# EAGLE schematic Power (EAGLE 9.6.2)
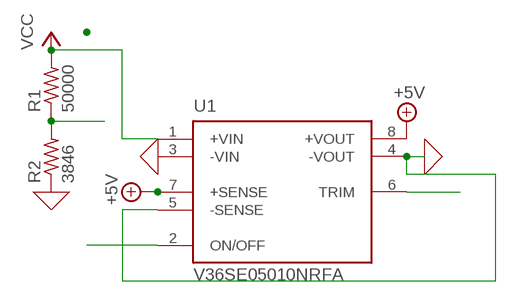
[diagram p0: schematic, sheet 1]

## Parts
R1  50000  R-US_0204/7  [0204/7]
R2  3846  R-US_0204/7  [0204/7]
U1  V36SE05010NRFA  [MODULE_V36SE05010NRFA]

## Nets
0: R2.1 U1.3(-VIN) U1.4(-VOUT) U1.5(-SENSE) ; supply symbol labelled GND
+5V: U1.7(+SENSE) U1.8(+VOUT)
N$2: U1.2(ON/OFF)
N$3: U1.6(TRIM)
N$4: R1.1 R2.2
VCC: R1.2 U1.1(+VIN)

## Library data of the parts
R1 R2 = rcl:R-US_: RESISTOR, American symbol; SPICEPREFIX: R
U1 = SnapEDA Library:V36SE05010NRFA: 16th brick 5V 10A; MANUFACTURER: Delta Electronics; MAXIMUM_PACKAGE_HEIGHT: 9.80mm; PARTREV: 03282018; STANDARD: IPC 7351B